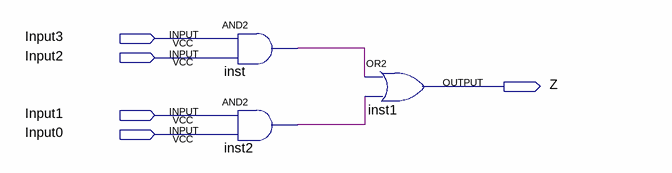
[diagram p0: schematic sheet]
// Quartus schematic comparator.bdf as structural Verilog: 3 symbols, 5 pins
module comparator (
  input  Input3,
  input  Input2,
  input  Input1,
  input  Input0,
  output Z
);

  wire inst2_out, inst_out;

  and inst (inst_out, Input3, Input2);
  and inst2 (inst2_out, Input1, Input0);
  or inst1 (Z, inst_out, inst2_out);
endmodule
